# Altium project PCB_Project.PrjPcb
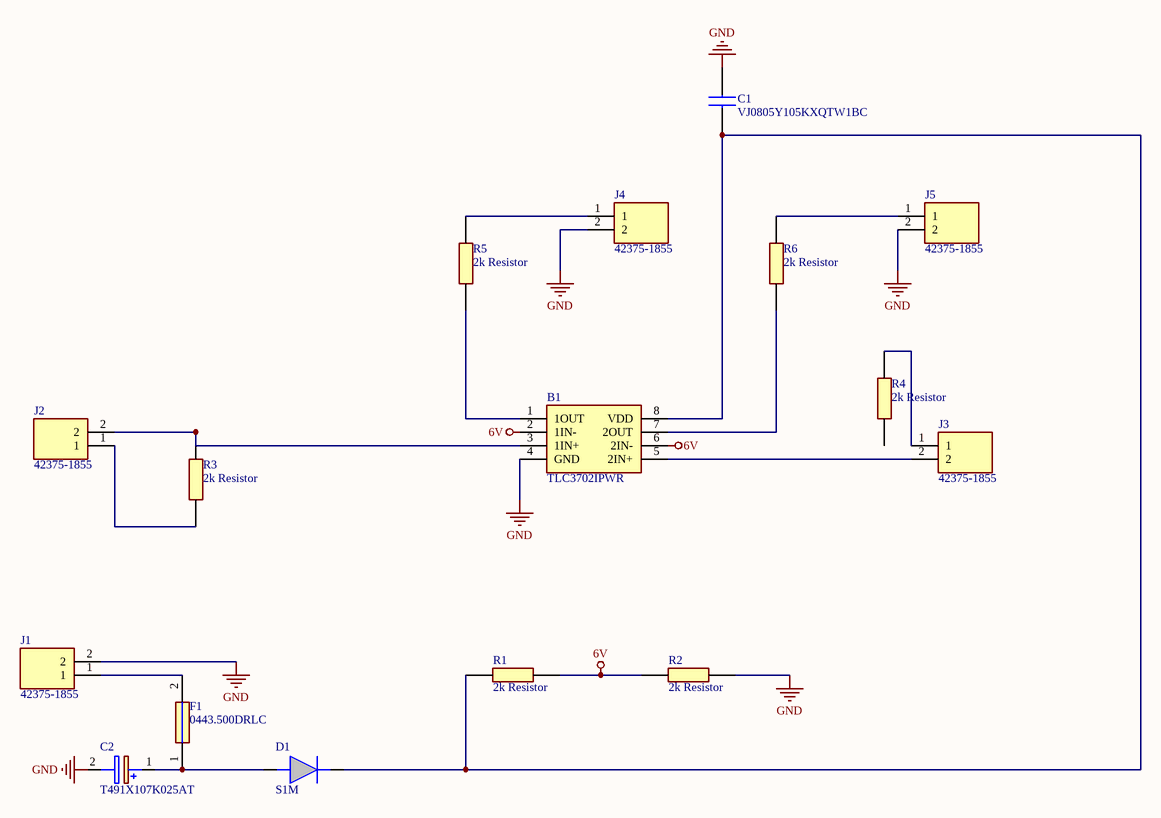
[diagram p0: LEDConverter.SchDoc]
1 sheet, 16 parts. Net scope: global (net labels, ports and power ports of the same name join across sheets).
Board file: LEDConverter.PcbDoc

## Sheet LEDConverter.SchDoc
size A3; SheetNumber: 1; SheetTotal: 1

### Parts
B1  TLC3702IPWR  [SOP65P640X120-8N]
C1  VJ0805Y105KXQTW1BC  [CAPC2012X135N]
C2  T491X107K025AT  [T491X]
D1  S1M  [DIOM5227X270N]
F1  0443.500DRLC  [0443500DR]
J1  42375-1855  [HDRV2W87P0X254_1X2_768X249X1494P]
J2  42375-1855  [HDRV2W87P0X254_1X2_768X249X1494P]
J3  42375-1855  [HDRV2W87P0X254_1X2_768X249X1494P]
J4  42375-1855  [HDRV2W87P0X254_1X2_768X249X1494P]
J5  42375-1855  [HDRV2W87P0X254_1X2_768X249X1494P]
R1  2k Resistor  [ERA6AEB101V]
R2  2k Resistor  [ERA6AEB101V]
R3  2k Resistor  [ERA6AEB101V]
R4  2k Resistor  [ERA6AEB101V]
R5  2k Resistor  [ERA6AEB101V]
R6  2k Resistor  [ERA6AEB101V]

### Nets
6V: B1.2(1IN-) B1.6(2IN-) R1.2 R2.1
GND: B1.4(GND) C1.2 C2.2(-) J1.2 J4.2 J5.2 R2.2
NetB1_1: B1.1(1OUT) R5.1
NetB1_3: B1.3(1IN+) J2.2 R3.2
NetB1_5: B1.5(2IN+) J3.2
NetB1_7: B1.7(2OUT) R6.1
NetB1_8: B1.8(VDD) C1.1 D1.1(K) R1.1
NetC2_1: C2.1(+) D1.2(A) F1.1
NetF1_2: F1.2 J1.1
NetJ2_1: J2.1 R3.1
NetJ3_1: J3.1 R4.2
NetJ4_1: J4.1 R5.2
NetJ5_1: J5.1 R6.2

Not connected (* = marked no-connect by the designer): R4 1

### Library data of the parts
B1 = TLC3702IPWR: Texas Instruments TLC3702IPWR Dual Comparator, Push-Pull O/P, 5 V 8-Pin TSSOP; Geometry.Height: 1.2mm; Mouser Part Number: 595-TLC3702IPWR; Mouser Price/Stock: https://www.mouser.co.uk/ProductDetail/Texas-Instruments/TLC3702IPWR?qs=p6lVfQR1GSqrayQICnP15w%3D%3D; Manufacturer_Name: Texas Instruments; Manufacturer_Part_Number: TLC3702IPWR; Datasheet Link: http://www.ti.com/lit/gpn/TLC3702
C1 = VJ0805Y105KXQTW1BC: Multilayer Ceramic Capacitors MLCC - SMD/SMT 0805 1uF 10volts X7R 10%; Manufacturer_Name: Vishay; Geometry.Height: 1.35mm; Mouser Part Number: 77-VJ0805Y105KXQTBC; Mouser Price/Stock: https://www.mouser.co.uk/ProductDetail/Vishay-Vitramon/VJ0805Y105KXQTW1BC?qs=F2lBERbFaaHnNHh23%2Flzkg%3D%3D; Manufacturer_Part_Number: VJ0805Y105KXQTW1BC; Datasheet Link: https://www.vishay.com/docs/28548/vjw1bcbascomseries.pdf
C2 = T491X107K025AT: Capacitor Polarised; Manufacturer_Name: KEMET; Datasheet Link: https://content.kemet.com/datasheets/KEM_T2005_T491.pdf; Height: 4.3mm; Manufacturer_Part_Number: T491X107K025AT; Mouser Part Number: 80-T491X107K025AT; Mouser Price/Stock: https://www.mouser.co.uk/ProductDetail/KEMET/T491X107K025AT?qs=QpHsZXO%252BQJ%252BKFgQiUckA6A%3D%3D; Arrow Part Number: T491X107K025AT; Arrow Price/Stock: https://www.arrow.com/en/products/t491x107k025at/kemet-corporation?utm_currency=USD&region=nac
D1 = S1M: Glass passivated junction.; Low profile package.; Manufacturer_Name: onsemi; Geometry.Height: 2.7mm; Mouser Part Number: 512-S1M; Mouser Price/Stock: https://www.mouser.co.uk/ProductDetail/onsemi-Fairchild/S1M?qs=RJwZ8kJo1mhFujnIpzoJdg%3D%3D; Manufacturer_Part_Number: S1M; Datasheet Link: https://www.onsemi.com/pub/Collateral/S1M-D.PDF
F1 = 0443.500DRLC: Fuse; Manufacturer_Name: LITTELFUSE; Datasheet Link: https://www.littelfuse.com/~/media/electronics/datasheets/fuses/littelfuse_fuse_443_datasheet.pdf.pdf; Height: 3.05mm; Manufacturer_Part_Number: 0443.500DRLC; Mouser Part Number: 576-0443.500DRLC; Mouser Price/Stock: https://www.mouser.co.uk/ProductDetail/Littelfuse/0443.500DRLC?qs=AQlKX63v8RvHlKjIINnTsQ%3D%3D; Arrow Part Number: 0443.500DRLC; Arrow Price/Stock: https://www.arrow.com/en/products/0443.500drlc/littelfuse?region=nac
J1-J5 = 42375-1855: Headers & Wire Housings KK 100 Hdr Assy Bkw 02 Ckt Tin; Manufacturer_Name: Molex; Geometry.Height: 14.94mm; Mouser Part Number: 538-42375-1855; Mouser Price/Stock: https://www.mouser.com/Search/Refine.aspx?Keyword=538-42375-1855; Manufacturer_Part_Number: 42375-1855; Datasheet Link: https://componentsearchengine.com/Datasheets/1/42375-1855.pdf
R1-R6 = ERA-6AED4990V: Metal Thin Film Chip Resistor, 0805, 0.125W; Manufacturer_Name: Panasonic; Geometry.Height: 0.6mm; Mouser Part Number: *; Mouser Price/Stock: *; Manufacturer_Part_Number: ERA-6AED4990V; Datasheet Link: https://industrial.panasonic.com/cdbs/www-data/pdf/RDM0000/AOA0000C307.pdf